# Altium schematic sheet Microcontroller.SchDoc
size A3
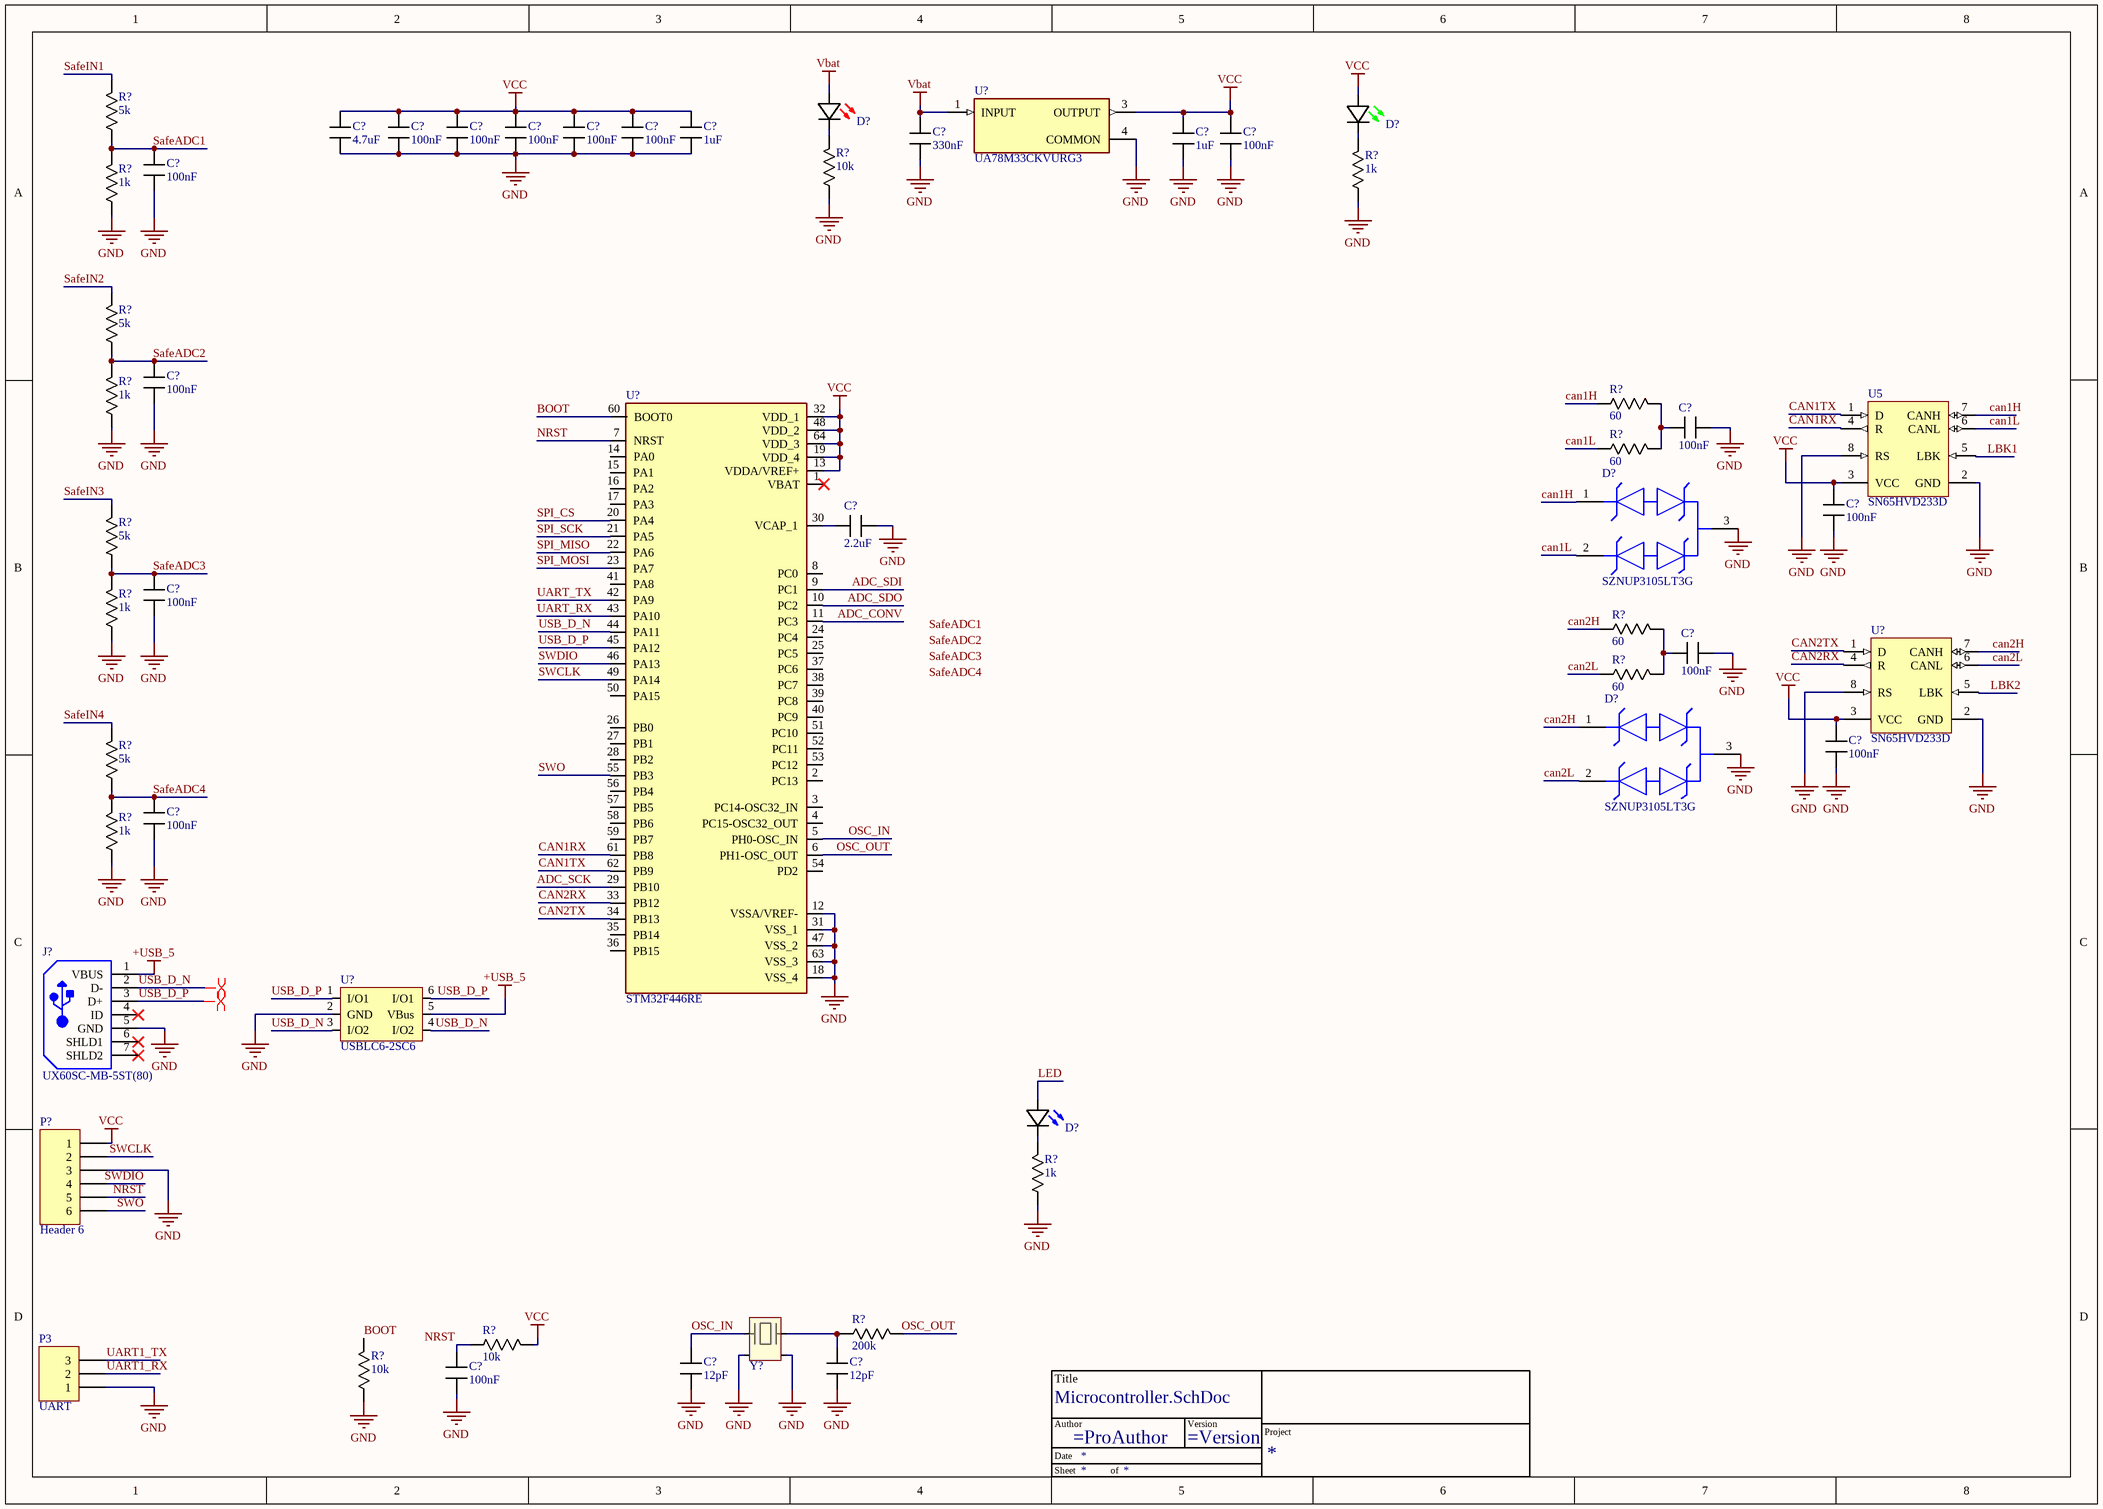
[diagram p0: Microcontroller.SchDoc]

## Parts
(Parts that share a designator on the sheet are numbered #1, #2 ... from top to bottom, then left to right.)
*  TitleBlock  (value not drawn)  (graphical)
C?#1  value 4.7uF  [C_0603]  (hidden comment: C)
C?#2  value 100nF  [C_0603]  (hidden comment: C)
C?#3  value 100nF  [C_0603]  (hidden comment: C)
C?#4  value 100nF  [C_0603]  (hidden comment: C)
C?#5  value 100nF  [C_0603]  (hidden comment: C)
C?#6  value 100nF  [C_0603]  (hidden comment: C)
C?#7  value 1uF  [C_0603]  (hidden comment: C)
C?#8  value 330nF  [C_0603]  (hidden comment: C)
C?#9  value 1uF  [C_0603]  (hidden comment: C)
C?#10  value 100nF  [C_0603]  (hidden comment: C)
C?#11  value 100nF  [C_0603]  (hidden comment: CL10B104KA8NNWC)
C?#12  value 100nF  [C_0603]  (hidden comment: CL10B104KA8NNWC)
C?#13  value 100nF  [C_0603]  (hidden comment: C)
C?#14  value 100nF  [C_0603]  (hidden comment: C)
C?#15  value 2.2uF  [C_0603]  (hidden comment: C)
C?#16  value 100nF  [C_0603]  (hidden comment: CL10B104KA8NNWC)
C?#17  value 100nF  [C_0603]  (hidden comment: C)
C?#18  value 100nF  [C_0603]  (hidden comment: C)
C?#19  value 100nF  [C_0603]  (hidden comment: CL10B104KA8NNWC)
C?#20  value 100nF  [C_0603]  (hidden comment: C)
C?#21  value 12pF  [0402]  (hidden comment: C)
C?#22  value 12pF  [0402]  (hidden comment: C)
D?#1  150060SS55040  [LED (0603)]  (value not drawn)
D?#2  150060GS55040  [LED (0603)]  (value not drawn)
D?#3  SZNUP3105LT3G  [FP-318-08-MFG]
D?#4  SZNUP3105LT3G  [FP-318-08-MFG]
D?#5  150060BS55040  [LED (0603)]  (value not drawn)
J?  UX60SC-MB-5ST(80)  [HIRO-UX60SC-MB-5ST(80)_V]
P3  UART  [HDR1X3]
P?  Header 6  [HDR1X6]
R?#1  value 5k  [R-0603]  (hidden comment: CR0603AFX-5101EAS)
R?#2  value 10k  [R-0603]  (hidden comment: Resistor)
R?#3  value 1k  [R-0603]  (hidden comment: Resistor)
R?#4  value 1k  [R-0603]  (hidden comment: SFR03EZPF1001)
R?#5  value 5k  [R-0603]  (hidden comment: CR0603AFX-5101EAS)
R?#6  value 60  [R-0603]  (hidden comment: Resistor)
R?#7  value 1k  [R-0603]  (hidden comment: SFR03EZPF1001)
R?#8  value 60  [R-0603]  (hidden comment: Resistor)
R?#9  value 5k  [R-0603]  (hidden comment: CR0603AFX-5101EAS)
R?#10  value 60  [R-0603]  (hidden comment: Resistor)
R?#11  value 1k  [R-0603]  (hidden comment: SFR03EZPF1001)
R?#12  value 60  [R-0603]  (hidden comment: Resistor)
R?#13  value 5k  [R-0603]  (hidden comment: CR0603AFX-5101EAS)
R?#14  value 1k  [R-0603]  (hidden comment: SFR03EZPF1001)
R?#15  value 1k  [R-0603]  (hidden comment: Resistor)
R?#16  value 200k  [0402]  (hidden comment: Resistor)
R?#17  value 10k  [R-0603]  (hidden comment: Resistor)
R?#18  value 10k  [R-0603]  (hidden comment: Resistor)
U5  SN65HVD233D  [D0008A_N]
U?#1  UA78M33CKVURG3  [TO229P990X252-3N]
U?#2  SN65HVD233D  [D0008A_N]
U?#3  STM32F446RE  [QFP50P1200X1200X160-64N]
U?#4  USBLC6-2SC6  [USBLC6-2SC6]
Y?  CX2016DB26000D0FLJCC  (value not drawn)

## Nets
+USB_5: J?.1(VBUS) U?#4.5(VBus)
GND: C?#1.1 C?#2.1 C?#3.1 C?#4.1 C?#5.1 C?#6.1 C?#7.1 C?#8.1 C?#9.1 C?#10.1 C?#11.1 C?#12.1 C?#13.1 C?#14.1 C?#15.1 C?#16.1 C?#17.1 C?#18.1 C?#19.1 C?#20.1 C?#21.1 C?#22.1 D?#3.3 D?#4.3 J?.5(GND) P3.1 P?.3 R?#2.1 R?#3.1 R?#4.1 R?#7.1 R?#11.1 R?#14.1 R?#15.1 R?#18.1 U5.2(GND) U5.8(RS) U?#1.4(COMMON) U?#2.2(GND) U?#2.8(RS) U?#3.12(VSSA/VREF-) U?#3.18(VSS_4) U?#3.31(VSS_1) U?#3.47(VSS_2) U?#3.63(VSS_3) U?#4.2(GND) Y?.2(GND) Y?.4(GND)
Vbat: C?#8.2 D?#1.2(A) U?#1.1(INPUT)
VCC: C?#1.2 C?#2.2 C?#3.2 C?#4.2 C?#5.2 C?#6.2 C?#7.2 C?#9.2 C?#10.2 C?#14.2 C?#18.2 D?#2.2(A) P?.1 R?#17.2 U5.3(VCC) U?#1.3(OUTPUT) U?#2.3(VCC) U?#3.13(VDDA/VREF+) U?#3.19(VDD_4) U?#3.32(VDD_1) U?#3.48(VDD_2) U?#3.64(VDD_3)
ADC_CONV: U?#3.11(PC3)
ADC_SCK: U?#3.29(PB10)
ADC_SDI: U?#3.9(PC1)
ADC_SDO: U?#3.10(PC2)
BOOT: R?#18.2 U?#3.60(BOOT0)
can1H: D?#3.1 R?#6.1 U5.7(CANH)
can1L: D?#3.2 R?#8.1 U5.6(CANL)
CAN1RX: U5.4(R) U?#3.61(PB8)
CAN1TX: U5.1(D) U?#3.62(PB9)
can2H: D?#4.1 R?#10.1 U?#2.7(CANH)
can2L: D?#4.2 R?#12.1 U?#2.6(CANL)
CAN2RX: U?#2.4(R) U?#3.33(PB12)
CAN2TX: U?#2.1(D) U?#3.34(PB13)
LBK1: U5.5(LBK)
LBK2: U?#2.5(LBK)
LED: D?#5.2(A)
NRST: C?#20.2 P?.5 R?#17.1 U?#3.7(NRST)
OSC_IN: C?#21.2 U?#3.5(PH0-OSC_IN) Y?.1
OSC_OUT: R?#16.2 U?#3.6(PH1-OSC_OUT)
SafeADC1: C?#11.2 R?#1.1 R?#4.2
SafeADC2: C?#12.2 R?#5.1 R?#7.2
SafeADC3: C?#16.2 R?#9.1 R?#11.2
SafeADC4: C?#19.2 R?#13.1 R?#14.2
SafeIN1: R?#1.2
SafeIN2: R?#5.2
SafeIN3: R?#9.2
SafeIN4: R?#13.2
SPI_CS: U?#3.20(PA4)
SPI_MISO: U?#3.22(PA6)
SPI_MOSI: U?#3.23(PA7)
SPI_SCK: U?#3.21(PA5)
SWCLK: P?.2 U?#3.49(PA14)
SWDIO: P?.4 U?#3.46(PA13)
SWO: P?.6 U?#3.55(PB3)
UART1_RX: P3.2
UART1_TX: P3.3
UART_RX: U?#3.43(PA10)
UART_TX: U?#3.42(PA9)
USB_D_N: J?.2(D-) U?#3.44(PA11) U?#4.3(I/O2) U?#4.4(I/O2)
USB_D_P: J?.3(D+) U?#3.45(PA12) U?#4.1(I/O1) U?#4.6(I/O1)
NetC?#13_2: C?#13.2 R?#6.2 R?#8.2
NetC?#15_2: C?#15.2 U?#3.30(VCAP_1)
NetC?#17_2: C?#17.2 R?#10.2 R?#12.2
NetC?#22_2: C?#22.2 R?#16.1 Y?.3
NetD?#1_1: D?#1.1(K) R?#2.2
NetD?#2_1: D?#2.1(K) R?#3.2
NetD?#5_1: D?#5.1(K) R?#15.2

Not connected (* = marked no-connect by the designer): J? 4(ID)* 6(SHLD1)* 7(SHLD2)*; U?#3 1(VBAT)* 2(PC13) 3(PC14-OSC32_IN) 4(PC15-OSC32_OUT) 8(PC0) 14(PA0) 15(PA1) 16(PA2) 17(PA3) 24(PC4) 25(PC5) 26(PB0) 27(PB1) 28(PB2) 35(PB14) 36(PB15) 37(PC6) 38(PC7) 39(PC8) 40(PC9) 41(PA8) 50(PA15) 51(PC10) 52(PC11) 53(PC12) 54(PD2) 56(PB4) 57(PB5) 58(PB6) 59(PB7)

## Layout directives
differential pair: USB_D_N, USB_D_P

## Notes on the sheet
- Labels drawn without touching a wire or pin: SafeADC1, SafeADC2, SafeADC3, SafeADC4
- (in symbol TitleBlock) Title; Author; Version; Project; Date; Sheet; of

## Library data of the parts
C?#1-C?#22 = Capacitor: ComponentLink1Description: New link; ComponentLink1URL: *
D?#1 = 150060SS55040: LED RED DIFFUSED 0603 SMD; Manufacturer: Wurth Electronics; Lens Style: Flat; Luminous Intensity: 70mcd; Forward Voltage: 2V; Test Current: 20mA; Viewing Angle: 140°; Dominant Wavelength: 630nm; Lens Size: 0.8mm; Supplier 1: Mouser; Manufacturer Part Number: 150060SS55040; RoHS: No; Category: LEDs; Stock 1: 17006; Pricing 1: 1=0.18000, 10=0.16800, 50=0.16800, 100=0.15200, 1000=0.12100, 10000=0.10600 (USD); Mount: Surface Mount; Case/Package: 0603; Color: Red; Case Code (Imperial): 0603; Case Code (Metric): 1608; Packaging: Tape and Reel; Lens Transparency: Diffused; Length: 1.6mm; Width: 0.8mm; Height: 0.5mm; RoHS Compliant: No; Supplier Part Number 1: 710-150060SS55040
D?#2 = 150060GS55040: LED GREEN DIFFUSED 0603 SMD; Manufacturer: Wurth Electronics; Lens Style: Flat; Luminous Intensity: 430mcd; Forward Voltage: 3.2V; Test Current: 20mA; Viewing Angle: 140°; Dominant Wavelength: 525nm; Lens Size: 0.8mm; Supplier 1: Mouser; Manufacturer Part Number: 150060GS55040; RoHS: No; Category: LEDs; Stock 1: 3998; Pricing 1: 1=0.23000, 10=0.21000, 50=0.21000, 100=0.19000, 1000=0.15200, 10000=0.13200 (USD); Mount: Surface Mount; Case/Package: 0603; Color: Green; Case Code (Imperial): 0603; Case Code (Metric): 1608; Packaging: Cut Tape; Lens Transparency: Diffused; Length: 1.6mm; Width: 0.8mm; Height: 0.5mm; RoHS Compliant: No; ComponentLink1URL: http://www.farnell.com/datasheets/2621642.pdf?src-supplier=Farnell; ComponentLink1Description: http://www.farnell.com/datasheets/2621642.pdf?src-supplier=Farnell; ComponentLink2URL: http://katalog.we-online.de/pbs/datasheet/150060GS55040.pdf?src-supplier=Digi-Key; ComponentLink2Description: http://katalog.we-online.de/pbs/datasheet/150060GS55040.pdf?src-supplier=Digi-Key; ComponentLink3URL: https://www.we-online.de/web/en/index.php/download/media/07_electronic_components/download_center_1/application_notes_berichte/ano002_leds___the_future_of_horticultural_lighting/ANO002b_EN_LEDs_The_Future_of_Horticultural_Lighting.pdf?src-supplier=Digi-Key; ComponentLink3Description: https://www.we-online.de/web/en/index.php/download/media/07_electronic_components/download_center_1/application_notes_berichte/ano002_leds___the_future_of_horticultural_lighting/ANO002b_EN_LEDs_The_Future_of_Horticultural_Lighting.pdf?src-supplier=Digi-Key; ComponentLink4URL: https://katalog.we-online.de/pbs/datasheet/150060GS55040.pdf?src-supplier=Digi-Key; ComponentLink4Description: https://katalog.we-online.de/pbs/datasheet/150060GS55040.pdf?src-supplier=Digi-Key; ComponentLink5URL: http://www.farnell.com/datasheets/2621642.pdf?src-supplier=Newark; ComponentLink5Description: http://www.farnell.com/datasheets/2621642.pdf?src-supplier=Newark; Supplier Part Number 1: 710-150060GS55040
D?#3 D?#4 = CMP-07200-000005-1: TVS DIODE 32V 66V SOT23-3; Manufacturer: ON Semiconductor; Capacitance: 30pF; Max Junction Temp: +150°C; Standoff Height: 0.01mm; Peak Pulse Power: 350W; Breakdown Voltage: 35.6V; Automotive Grade: Grade 0; Number Of Channels: 2; Value: 30pF; Direction: Bidirectional; Peak Pulse Current: 8A; Height: 1.11mm; Mouser Description: 32V Dual Line CAN Bus Protector in SOT-23 AEC-Q 24 V CAN Bus Protector in SOT-23; Device Class L3: unset; Clamping Voltage: 66V; Manufacturer Part Number: SZNUP3105LT3G; ComponentLink2Description: Datasheet; Octopart: https://octopart.com/sznup3105lt3g-on+semiconductor-54318507; Temperature Range High: +150°C; Reverse Standoff Voltage: 32V; RoHS: TRUE; Package: 318-08; Device Class L2: TVS Diodes; Device Class L1: Circuit Protection; Temperature Range Low: -55°C; Lead Free: Yes; Temperature: -55°C to +150°C; ComponentLink2URL: https://www.onsemi.com/pub/Collateral/NUP3105L-D.PDF; Automotive: Yes; Footprint Url: https://www.onsemi.com/pub/Collateral/318-08.PDF; Digikey Description: TVS DIODE 32V 66V SOT23-3; Category: Diode
D?#5 = 150060BS55040: LED BLUE DIFFUSED 0603 SMD; Manufacturer: Wurth Electronics; Lens Style: Flat; Luminous Intensity: 80mcd; Forward Voltage: 3.2V; Test Current: 20mA; Viewing Angle: 140°; Dominant Wavelength: 470nm; Lens Size: 0.8mm; Supplier 1: Mouser; Manufacturer Part Number: 150060BS55040; RoHS: No; Pricing 1: 1=0.18000, 10=0.16800, 50=0.16800, 100=0.15200, 1000=0.12100, 10000=0.10600 (USD); Mount: Surface Mount; Case/Package: 0603; Color: Blue; Packaging: Tape and Reel; Lens Transparency: Diffused; Length: 1.6mm; Width: 0.8mm; Height: 0.5mm; RoHS Compliant: No; ComponentLink1URL: http://www.farnell.com/datasheets/2621640.pdf?src-supplier=Farnell; ComponentLink1Description: http://www.farnell.com/datasheets/2621640.pdf?src-supplier=Farnell; ComponentLink2URL: https://www.we-online.de/web/en/index.php/download/media/07_electronic_components/download_center_1/application_notes_berichte/ano002_leds___the_future_of_horticultural_lighting/ANO002b_EN_LEDs_The_Future_of_Horticultural_Lighting.pdf?src-supplier=Digi-Key; ComponentLink2Description: https://www.we-online.de/web/en/index.php/download/media/07_electronic_components/download_center_1/application_notes_berichte/ano002_leds___the_future_of_horticultural_lighting/ANO002b_EN_LEDs_The_Future_of_Horticultural_Lighting.pdf?src-supplier=Digi-Key; ComponentLink3URL: https://katalog.we-online.de/pbs/datasheet/150060BS55040.pdf?src-supplier=Digi-Key; ComponentLink3Description: https://katalog.we-online.de/pbs/datasheet/150060BS55040.pdf?src-supplier=Digi-Key; ComponentLink4URL: http://www.farnell.com/datasheets/2621640.pdf?src-supplier=Newark; ComponentLink4Description: http://www.farnell.com/datasheets/2621640.pdf?src-supplier=Newark; Supplier Part Number 1: 710-150060BS55040
J? = CMP-2000-07376-1: Mini-B Connector, SMT Mount Receptacle Meeting Requirement of USB 2.0 Standard, 5 V, 1 A, -30 to 75 degC, 5-Pin SMD, RoHS, Tape and Reel; Manufacturer: Hirose Electric; Product Length (mm): 7.7mm; Voltage Rating Max: 5VAC; Number of Contacts: 5POS; Number of Ports: 1Port; Product Height (mm): 3.95mm; Product Depth (mm): 7mm; Pitch (mm): 0.8mm; Gender: RCP; Current Rating (Max): 1A; DELETED: Compliant; Product Diameter (mm): NotRequiredmm; Body Orientation: RightAngle; Operating Temp Range: -30Cto75C; Packaging: TapeandReel; Termination Method: Solder; Number of Terminals: 5; Package Description: 5-Pin Surface Mount Device, Body 7.7 x 7 mm, Pitch 0.8 mm; Mounting Technology: SurfaceMount; Contact Material: CopperAlloy; Package Reference: UX60SC-MB-5ST(80); Operating Temperature Min Deg. C: -30C; Housing Material: Synthetic; Operating Temperature Max Deg. C: 75C; Manufacturer URL: https://www.hirose.com; Datasheet Version: 04/2008; Type: Mini-USB; Datasheet URL: https://datasheet.ciiva.com/4598/e24000153-34949-4598883.pdf; Contact Plating: Gold; Mounting Style: ThroughHole
P3 = Header 3: Header, 3-Pin; Manufacturer: -; Mfg No.: -; Notes: -; Suppl. Link/No.: -; Supplier: Digikey; Value: -
P? = Header 6: Header, 6-Pin; LatestRevisionDate: 17-Jul-2002; LatestRevisionNote: Re-released for DXP Platform.; Publisher: Altium Limited
R?#1 R?#4 R?#5 R?#7 R?#9 R?#11 R?#13 R?#14 = Resistor: Voltage divider
U5 U?#2 = CMP-0315-00036-2: 3.3V CAN Transceiver with Standby Mode, Loop-back, 6 mA, -40 to 125 degC, 8-pin SOIC (D), Green (RoHS & no Sb/Br); Manufacturer: Texas Instruments; Receivers Per Package: 1; Bus Fault Voltage(V): +/-30; Rating: Catalog; ICC(Max)(mA): 6; Supply Voltage(s)(V): 3.3; Transient Pulse Protection(V): -100 to 100; PackageVersion: revM, Jun-2011; PackageReference: D0008A; ComponentLink1Description: Datasheet; Isolated: No; Footprint: PCA82C250, excludes pin5; DatasheetVersion: SLLS557F; PackageDescription: 8-Pin Plastic Small Outline Integrated Circuit, 4.9 x 3.9 mm, Pitch 1.27 mm Pitch; Features: Loop Back; Low Power Mode: Standby; SubFamily: CAN; Drivers Per Package: 1; Eco-Plan: Green (RoHS & no Sb/Br); ComponentLink1URL: http://www.ti.com/general/docs/lit/getliterature.tsp?genericPartNumber=SN65HVD233&fileType=pdf; PartNumber: SN65HVD233D; Code_JEDEC: MS-012AA; Mounting Technology: Surface Mount
U?#3 = STM32F446RE: 32 Bit Microcontroller, High Performance, ARM Cortex-M4, 180 MHz, 256 KB, 128 KB, 64, LQFP; MP: STM32F446RE; Value: *
U?#4 = USBLC6-2SC6: TVS DIODE 5.25V 17V SOT23-6; Manufacturer: STMicroelectronics; Direction: Unidirectional,Bidirectional; Capacitance: 3.5pF; Operating Supply Voltage: 1.1V; Number of Channels: 2; Breakdown Voltage: 6V; Power Line Protection: Yes; Test Current: 1mA; Max Reverse Leakage Current: 150nA; Peak Pulse Current: 5A; Element Configuration: Dual; Data Rate: 480Mbps; Number of Elements: 1; Working Voltage: 5V; Supplier 1: RSComponents; Manufacturer Part Number: USBLC6-2SC6; RoHS: Yes; Category: TVS Diodes; Stock 1: 1; Pricing 1: 10=0.61400, 50=0.57700, 100=0.54700, 250=0.51600, 500=0.49000 (USD); Mount: Surface Mount; Case/Package: SOT-23; Number of Pins: 6; Contact Plating: Tin,Matte; Min Operating Temperature: -40°C; Max Operating Temperature: 125°C; Clamping Voltage: 17V; Packaging: Tape and Reel; Package Quantity: 3000; Termination: SMD/SMT; Number of Bidirectional Channels: 2; Reverse Standoff Voltage: 5.25V; Min Breakdown Voltage: 6V; ESD Protection: Yes; Leakage Current: 150nA; Series: USB; Reverse Breakdown Voltage: 6V; Polarity: Unidirectional,Bidirectional; Max Breakdown Voltage: 6V; Clamping Voltage-Max: 17V; Length: 3.05mm; Width: 1.75mm; Height: 1.3mm; Depth: 1.75mm; Radiation Hardening: No; REACH SVHC: No SVHC; Lead Free: Lead Free; RoHS Compliant: Yes; ComponentLink1URL: https://datasheet.ciiva.com/1268/1690354-1268384.pdf?src-supplier=Element14; ComponentLink1Description: https://datasheet.ciiva.com/1268/1690354-1268384.pdf?src-supplier=Element14; ComponentLink2URL: https://datasheet.ciiva.com/4508/cd00050750-113117-4508433.pdf?src-supplier=Mouser; ComponentLink2Description: https://datasheet.ciiva.com/4508/cd00050750-113117-4508433.pdf?src-supplier=Mouser; ComponentLink3URL: https://datasheet.ciiva.com/15143/getdatasheetpartid-148465-15143789.pdf?src-supplier=Verical; ComponentLink3Description: https://datasheet.ciiva.com/15143/getdatasheetpartid-148465-15143789.pdf?src-supplier=Verical; ComponentLink4URL: https://datasheet.ciiva.com/26787/usblc6-2sc6-26787908.pdf?src-supplier=IIIC; ComponentLink4Description: https://datasheet.ciiva.com/26787/usblc6-2sc6-26787908.pdf?src-supplier=IIIC; ComponentLink5URL: https://datasheet.ciiva.com/16200/cd00050750-16200026.pdf?src-supplier=Future+Electronics; ComponentLink5Description: https://datasheet.ciiva.com/16200/cd00050750-16200026.pdf?src-supplier=Future+Electronics; ComponentLink6URL: https://datasheet.ciiva.com/41444/001184109-da-01-en-ic-esd-protecti-usblc6-2sc6-sot-23-6-stm-41444156.pdf?src-supplier=Conrad; ComponentLink6Description: https://datasheet.ciiva.com/41444/001184109-da-01-en-ic-esd-protecti-usblc6-2sc6-sot-23-6-stm-41444156.pdf?src-supplier=Conrad; Supplier Part Number 1: 6247693
Y? = CX2016DB26000D0FLJCC: Crystals AEC-Q200 26000kHz 8pF 2x1.6mm
U?#1 = UA78M33CKVURG3: MP: UA78M33CKVURG3; Value: *